# EAGLE design BMP280_board (EAGLE 7.1.0)
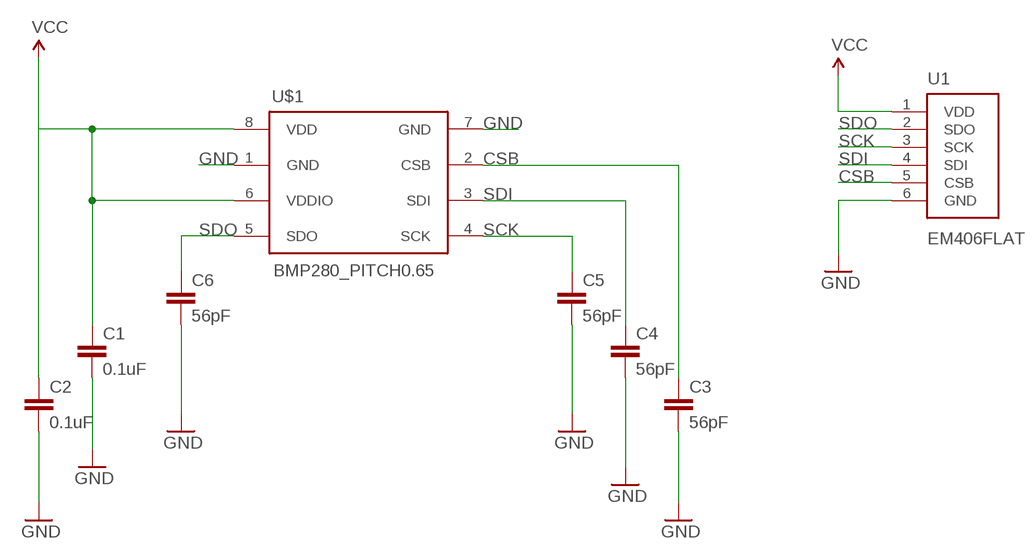
[diagram p0: schematic, sheet 1]

## Parts
C1  0.1uF  0.1UF-25V(+80/-20%)(0603)  [0603-CAP]
C2  0.1uF  0.1UF-25V(+80/-20%)(0603)  [0603-CAP]
C3  56pF  0.1UF-25V(+80/-20%)(0603)  [0603-CAP]
C4  56pF  0.1UF-25V(+80/-20%)(0603)  [0603-CAP]
C5  56pF  0.1UF-25V(+80/-20%)(0603)  [0603-CAP]
C6  56pF  0.1UF-25V(+80/-20%)(0603)  [0603-CAP]
U1  EM406FLAT  [EM406-FLAT]
U$1  BMP280_PITCH0.65  [LGA-8]

## Nets
CSB: C3.1 U1.5(CSB) U$1.2(CSB)
GND: C1.2 C2.2 C3.2 C4.2 C5.2 C6.2 U1.6(GND) U$1.1(GND) U$1.7(GND)
SCK: C5.1 U1.3(SCK) U$1.4(SCK)
SDI: C4.1 U1.4(SDI) U$1.3(SDI)
SDO: C6.1 U1.2(SDO) U$1.5(SDO)
VCC: C1.1 C2.1 U1.1(VDD) U$1.6(VDDIO) U$1.8(VDD)

## Library data of the parts
C1 C2 = SparkFun-Capacitors:0.1UF-25V(+80/-20%)(0603): CAP-00810 Ceramic Standard decoupling cap; PROD_ID: CAP-00810
C3-C6 = SparkFun-Capacitors:0.1UF-25V(+80/-20%)(0603): CAP-00810 Ceramic Standard decoupling cap; PROD_ID: CAP-00810; VALUE: 0.1uF
U1 = icarus_sensors:EM406: EM406 GPS Connector Proven layout and schematic for EM406 connector. Spark Fun Electronics SKU : GPS-00579
U$1 = icarus_sensors:BMP280: Bosch BMP280 presssure sensor

## Board
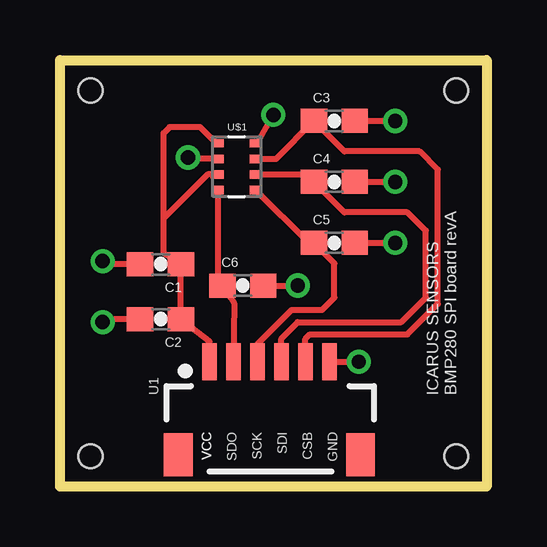
[diagram p1: board, top side]
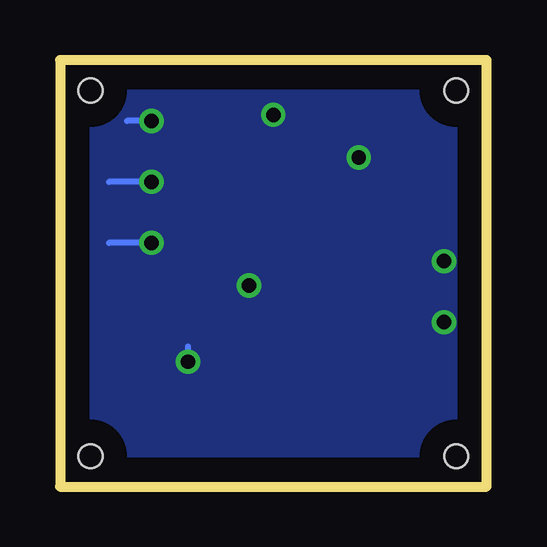
[diagram p2: board, bottom side, seen from below]

Size 17.78 x 17.78 mm. Coordinates in mm from the lower left corner, seen from the top.
Outline: 0,0 0,17.78 17.78,17.78 17.78,0 0,0
Copper layers (1*16): Top 0.035mm / dielectric 1.5mm / Bottom 0.035mm
Design rules "default": minimum track width 10mil, minimum drill 24mil, track to track 8mil, track to pad 8mil, pad to pad 8mil, via to via 8mil, smd to smd 8mil, copper to edge 40mil, drill to drill 8mil, minimum pad ring 10mil, minimum via ring 8mil, stop-mask expansion 4mil, vias tented up to drill 0mil, thermal gap 10mil
Holes 1 mm at 1.27,16.51 16.51,16.51 16.51,1.27 1.27,1.27

### Footprints (pad centres in the part's own frame; a part is rotated, then mirrored left to right if it is on the bottom)
0603-CAP = smd 1.1 x 1: 1 -0.85,0; 2 0.85,0
EM406-FLAT = smd 0.6 x 1.55: 1 -2.54,2.92; 2 -1.54,2.92; 3 -0.54,2.92; 4 0.46,2.92; 5 1.46,2.92; 6 2.46,2.92 | smd 1.2 x 1.8: P$1 -3.84,-0.955; P$2 3.76,-0.955
LGA-8 = smd 0.5 x 0.35: 1 0.8,0.975; 2 0.8,0.325; 3 0.8,-0.325; 4 0.8,-0.975; 5 -0.8,-0.975; 6 -0.8,-0.325; 7 -0.8,0.325; 8 -0.8,0.975

### Placement (x,y rotation side)
C1  4.19,9.27 180 top
C2  4.19,6.98 180 top
C3  11.43,15.24 0 top
C4  11.43,12.7 0 top
C5  11.43,10.16 0 top
C6  7.62,8.38 0 top
U1  8.76,2.29 0 top
U$1  7.37,13.33 0 top

### Tracks (layer width: path | path; a pad name or v marks a point on that pad's centre or on a via)
CSB
  Top 0.254: U1.5 10.22,6.16 10.41,6.35 14.48,6.35 15.75,7.62 15.75,13.21 14.99,13.97 11.85,13.97 C3.1 9,13.66 U$1.2
GND  (via drill 0.6)
  Top 0.254: U1.6 v12.45,5.21 | C3.2 v13.97,15.24 | C4.2 v13.97,12.7 | C5.2 v13.97,10.16 | C2.2 1.91,6.98 v1.78,6.86 | C1.2 1.65,9.27 v1.78,9.4 | U$1.7 5.39,13.66 v5.33,13.72 | C6.2 v9.91,8.38 | U$1.1 8.21,14.31 v8.89,15.49
  Bottom 0.254: v12.45,5.21 12.45,5.84 | v13.97,15.24 14.99,15.24 | v13.97,12.7 15.75,12.7 | v13.97,10.16 15.75,10.16 | v1.78,6.86 2.03,6.86 | v5.33,13.72 5.08,13.72 | v1.78,9.4 1.52,9.65 | v9.91,8.38 10.16,8.38 | v8.89,15.49 8.64,15.24
  pour Bottom: 0.51,17.27 0.51,0.51 17.27,0.51 17.27,17.27
SCK
  Top 0.254: U1.3 8.22,5.94 9.65,7.37 10.92,7.37 11.43,7.87 11.43,9.31 C5.1 10.37,10.16 U$1.4
SDI
  Top 0.254: U1.4 9.22,6.18 9.91,6.86 14.22,6.86 15.24,7.87 15.24,10.67 14.48,11.43 11.85,11.43 C4.1 10.27,13.01 U$1.3
SDO
  Top 0.254: U$1.5 6.57,8.59 C6.1 7.25,7.65 U1.2
VCC
  Top 0.254: U1.1 6.22,6.06 C2.1 C1.1 | U$1.6 6.51,12.95 6.35,12.95 6.41,13.01 U$1.6 | U$1.8 6.52,14.31 5.84,14.99 4.57,14.99 4.32,14.73 4.32,11.18 | 4.83,9.31 C1.1 | 4.32,11.18 4.32,9.74 C1.1 | U$1.6 6.15,13.01 4.32,11.18

### Text on the board
tNames: ICARUS SENSORS / BMP280 SPI board revA